# Altium schematic sheet Audio.SchDoc
size A4
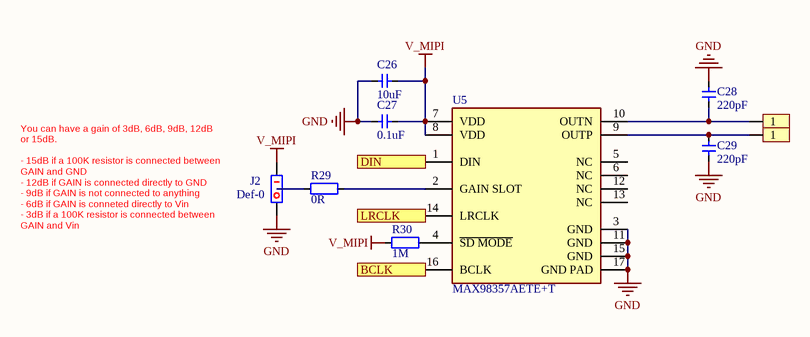
[diagram p0: Audio.SchDoc]

## Parts
*1  SPEAKER  [SPEAKER]  (value not drawn)
*2  SPEAKER  [SPEAKER]  (value not drawn)
C26  10uF  [CAP_0402]
C27  0.1uF  [CAP_0402]
C28  220pF  [CAP_0402]
C29  220pF  [CAP_0402]
J2  Def-0  [jumper-3]
R29  0R  [RES_0402]
R30  1M  [RES_0402]
U5  Part Number: MAX98357AETE+T  [TQFN-16]  (hidden comment: MAX98357AETE)

## Ports
BCLK (in), DIN (in), LRCLK (in)

## Nets
GND: C26.1 C27.1 C28.2 C29.2 J2.1 U5.3(GND) U5.11(GND) U5.15(GND) U5.17(GND_PAD)
V_MIPI: C26.2 C27.2 J2.3 R30.1 U5.7(VDD) U5.8(VDD)
BCLK: U5.16(BCLK) ; port BCLK
DIN: U5.1(DIN) ; port DIN
LRCLK: U5.14(LRCLK) ; port LRCLK
Net*1_1: *1.1 C28.1 U5.10(OUTN)
Net*2_1: *2.1 C29.1 U5.9(OUTP)
NetJ2_2: J2.2 R29.1
NetR29_2: R29.2 U5.2(GAIN_SLOT)
NetR30_2: R30.2 U5.4(~{SD_MODE})

Not connected (* = marked no-connect by the designer): U5 5(NC) 6(NC) 12(NC) 13(NC)

## Notes on the sheet
- You can have a gain of 3dB, 6dB, 9dB, 12dB or 15dB.
  - 15dB if a 100K resistor is connected between GAIN and GND
  - 12dB if GAIN is connected directly to GND
  - 9dB if GAIN is not connected to anything
  - 6dB if GAIN is conneted directly to Vin
  - 3dB if a 100K resistor is connected between GAIN and Vin

## Library data of the parts
C26-C29 = 电容-0402: Capacitor; Value: 0.1u
J2 = 选择跳线: Resistor; Published: 8-Jun-2000; LatestRevisionDate: 17-Jul-2002; LatestRevisionNote: Re-released for DXP Platform.; PackageReference: AXIAL-0.4; Publisher: Altium Limited; PackageDescription: Axial Device, Thru-Hole; 2 Leads; 0.4 in Pin Spacing
R29 R30 = 电阻-0402: Resistor; Value: 22R
U5 = MAX98357AETE: IC Amplifier IC 2-Channel (Stereo) Class D 16-TQFN (3x3); Manufacturer: Maxim Electronics; Mfg Package Ident: 21-0896; helpURL: https://upverter.com/upn/revision/0f54a4b5bdb80fd2/; ComponentLink2Description: Datasheet; Temperature: +40°C to +85°C; Package: 21-0896; Supplier 2: Mouser; Price: 1.00367999051; Supplier 1: Digi-Key; ComponentLink1URL: https://upverter.com/upn/revision/0f54a4b5bdb80fd2/; Supplier Part Number 2: 700-MAX98357AETE+T; Supplier Part Number 1: MAX98357AETE+T-ND; ComponentLink1Description: Upverter; ComponentLink2URL: http://datasheets.maximintegrated.com/en/ds/MAX98357A-MAX98357B.pdf; RoHS: TRUE; Mouser Part Number: 700-MAX98357AETE+T; Temperature Range High: +85°C; Digikey Description: IC Amplifier IC 2-Channel (Stereo) Class D 16-TQFN (3x3); Digikey Part Number: MAX98357AETE+T-ND; Lead Free: yes; Temperature Range Low: +40°C